# Altium project Madromys.PrjPCB
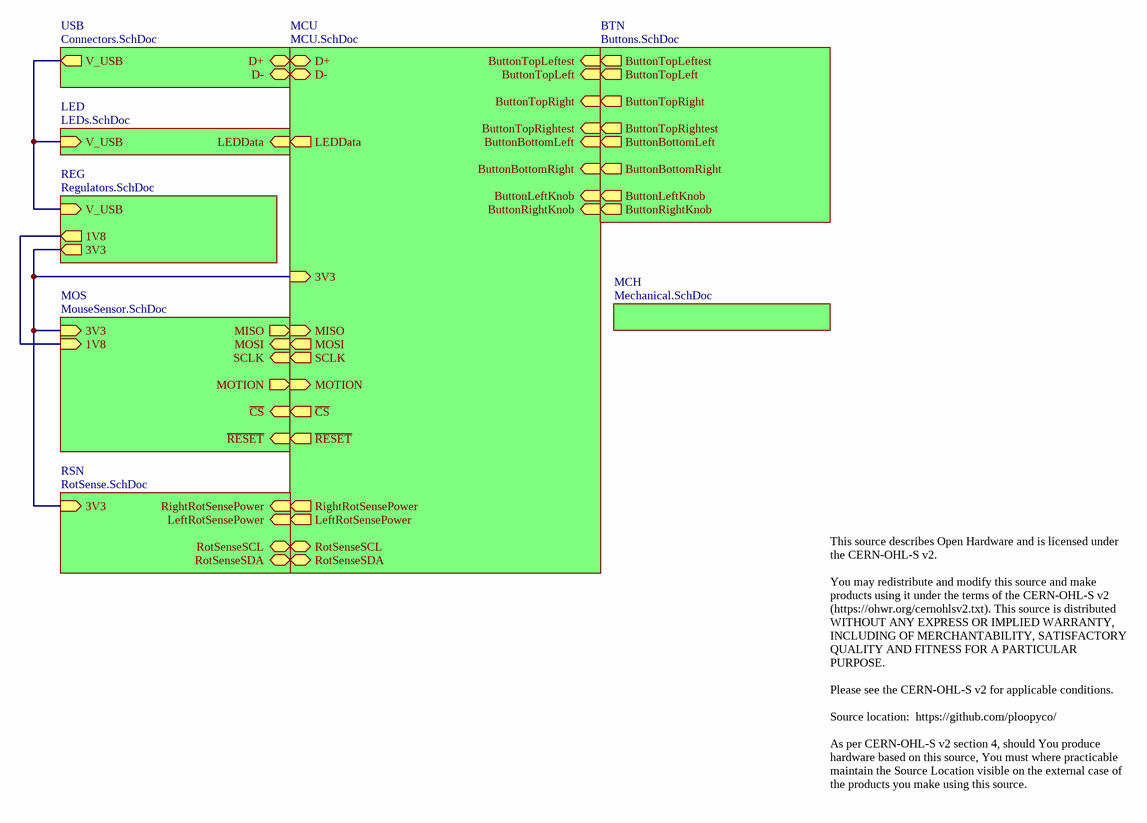
[diagram p0: Madromys.SchDoc]
9 sheets, 86 parts. Net scope: hierarchical (ports join the sheet entries above them; power ports are global).
Board file: Madromys.PcbDoc
Sheets:
  Madromys.SchDoc
    USB = Connectors.SchDoc
    LED = LEDs.SchDoc
    REG = Regulators.SchDoc
    MOS = MouseSensor.SchDoc
    MCU = MCU.SchDoc
    BTN = Buttons.SchDoc
    MCH = Mechanical.SchDoc
    RSN = RotSense.SchDoc

## Sheet Madromys.SchDoc
size Letter; CompanyName: Ploopy Corporation; Organization: Ploopy Corporation; Address1: 137-1140 Burnhamthorpe Road W; Address2: Mississauga; Address3: Ontario; Address4: Canada L5C 0A3; DocumentNumber: 1; Revision: R2.002; SheetNumber: 1; SheetTotal: 9

### Sub-sheets
BTN = Buttons.SchDoc: ButtonTopLeftest (out), ButtonTopLeft (out), ButtonTopRightest (out), ButtonBottomRight (out), ButtonBottomLeft (out), ButtonTopRight (out), ButtonLeftKnob (out), ButtonRightKnob (out)
LED = LEDs.SchDoc: V_USB (in), LEDData (in)
MCH = Mechanical.SchDoc: no entries
MCU = MCU.SchDoc: D+ (bidir), D- (bidir), ButtonTopLeftest (in), ButtonTopLeft (in), LEDData (out), 3V3 (in), MOSI (out), SCLK (out), MISO (in), ~{CS} (out), ~{RESET} (out), MOTION (in), ButtonTopRight (in), ButtonTopRightest (in), ButtonBottomRight (in), ButtonBottomLeft (in), ButtonLeftKnob (in), ButtonRightKnob (in), RightRotSensePower (out), LeftRotSensePower (out), RotSenseSCL (bidir), RotSenseSDA (bidir)
MOS = MouseSensor.SchDoc: 1V8 (in), 3V3 (in), ~{CS} (in), MISO (out), MOSI (in), SCLK (in), ~{RESET} (in), MOTION (out)
REG = Regulators.SchDoc: 3V3 (out), V_USB (in), 1V8 (out)
RSN = RotSense.SchDoc: RightRotSensePower (in), 3V3 (in), LeftRotSensePower (in), RotSenseSCL (bidir), RotSenseSDA (bidir)
USB = Connectors.SchDoc: D+ (bidir), V_USB (out), D- (bidir)

### Nets
1V8: sheet REG/1V8, sheet MOS/1V8
3V3: sheet REG/3V3, sheet MOS/3V3, sheet MCU/3V3, sheet RSN/3V3
LEDData: sheet LED/LEDData, sheet MCU/LEDData
V_USB: sheet USB/V_USB, sheet LED/V_USB, sheet REG/V_USB
NetC9_2: sheet MCU/LeftRotSensePower, sheet RSN/LeftRotSensePower
NetC15_2: sheet MCU/RightRotSensePower, sheet RSN/RightRotSensePower
NetR5_1: sheet MOS/MISO, sheet MCU/MISO
NetR6_2: sheet USB/D-, sheet MCU/D-
NetR7_2: sheet USB/D+, sheet MCU/D+
NetRa2_1: sheet MCU/RotSenseSCL, sheet RSN/RotSenseSCL
NetRa2_3: sheet MCU/RotSenseSDA, sheet RSN/RotSenseSDA
NetSW1_B: sheet MCU/ButtonTopLeftest, sheet BTN/ButtonTopLeftest
NetSW2_B: sheet MCU/ButtonTopLeft, sheet BTN/ButtonTopLeft
NetSW3_B: sheet MCU/ButtonTopRightest, sheet BTN/ButtonTopRightest
NetSW4_B: sheet MCU/ButtonTopRight, sheet BTN/ButtonTopRight
NetSW5_A: sheet MCU/ButtonLeftKnob, sheet BTN/ButtonLeftKnob
NetSW6_B: sheet MCU/ButtonBottomRight, sheet BTN/ButtonBottomRight
NetSW7_A: sheet MCU/ButtonRightKnob, sheet BTN/ButtonRightKnob
NetSW8_B: sheet MCU/ButtonBottomLeft, sheet BTN/ButtonBottomLeft
NetU2_7: sheet MOS/~{RESET}, sheet MCU/~{RESET}
NetU2_9: sheet MOS/MOTION, sheet MCU/MOTION
NetU2_10: sheet MOS/SCLK, sheet MCU/SCLK
NetU2_11: sheet MOS/MOSI, sheet MCU/MOSI
NetU2_13: sheet MOS/~{CS}, sheet MCU/~{CS}

### Notes on the sheet
- This source describes Open Hardware and is licensed under the CERN-OHL-S v2.
  You may redistribute and modify this source and make products using it under the terms of the CERN-OHL-S v2 (https://ohwr.org/cernohlsv2.txt). This source is distributed WITHOUT ANY EXPRESS OR IMPLIED WARRANTY, INCLUDING OF MERCHANTABILITY, SATISFACTORY QUALITY AND FITNESS FOR A PARTICULAR PURPOSE.
  Please see the CERN-OHL-S v2 for applicable conditions.
  Source location:  https://github.com/ploopyco/
  As per CERN-OHL-S v2 section 4, should You produce hardware based on this source, You must where practicable maintain the Source Location visible on the external case of the products you make using this source.
- Copyright Ploopy Corporation
- Licensed under the CERN-OHL-S v2
- http://ohwr.org/cernohl
- Title:
- PCB:
- Version:
- Ploopy Corporation
- Mississauga ON L5C 0A3
- 137-1140 Burnhamthorpe Road W
- Date:
- Time:
- Sheet
- of
- Canada

## Sheet Connectors.SchDoc
size Letter; CompanyName: Ploopy Corporation; Organization: Ploopy Corporation; Address1: 137-1140 Burnhamthorpe Road W; Address2: Mississauga; Address3: Ontario; Address4: Canada L5C 0A3; DocumentNumber: 3; Revision: R2.002; SheetNumber: 3; SheetTotal: 9
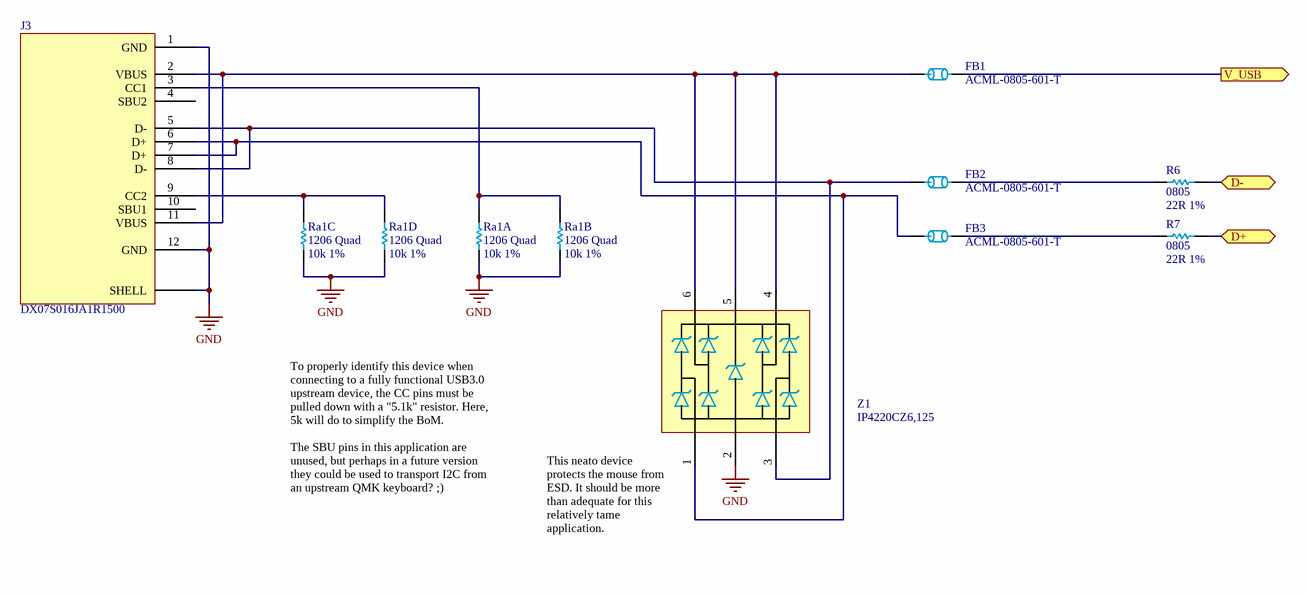
[diagram p1: Connectors.SchDoc]

### Parts
FB1  ACML-0805-601-T  [0805]
FB2  ACML-0805-601-T  [0805]
FB3  ACML-0805-601-T  [0805]
J3  DX07S016JA1R1500  [DX07S016JA1R1500]
R6  0805  value 22R 1%  [0805]
R7  0805  value 22R 1%  [0805]
Ra1  1206 Quad  value 10k 1%  [4x 10k 1% - CAC-80P320X160-8M]  (parts A,B,C,D of 4)
Z1  IP4220CZ6,125  [PESD3V3S4UD - SOT95P275X110-6N]

### Ports
D+ (bidir), D- (bidir), V_USB (out)

### Nets
GND: J3.1(GND) J3.12(GND) J3.SHELL Ra1.1 Ra1.2 Ra1.3 Ra1.4 Z1.2
V_USB: FB1.2 ; port V_USB
NetFB1_1: FB1.1 J3.2(VBUS) J3.11(VBUS) Z1.4 Z1.5 Z1.6
NetFB2_1: FB2.1 J3.5(D-) J3.8(D-) Z1.3
NetFB2_2: FB2.2 R6.1
NetFB3_1: FB3.1 J3.6(D+) J3.7(D+) Z1.1
NetFB3_2: FB3.2 R7.1
NetJ3_3: J3.3(CC1) Ra1.7 Ra1.8
NetJ3_9: J3.9(CC2) Ra1.5 Ra1.6
NetR6_2: R6.2 ; port D-
NetR7_2: R7.2 ; port D+

Not connected (* = marked no-connect by the designer): J3 4(SBU2) 10(SBU1)

### Notes on the sheet
- To properly identify this device when connecting to a fully functional USB3.0 upstream device, the CC pins must be pulled down with a "5.1k" resistor. Here, 5k will do to simplify the BoM.
  The SBU pins in this application are unused, but perhaps in a future version they could be used to transport I2C from an upstream QMK keyboard? ;)
- (near Z1) This neato device protects the mouse from ESD. It should be more than adequate for this relatively tame application.
- Copyright Ploopy Corporation
- Licensed under the CERN-OHL-S v2
- http://ohwr.org/cernohl
- Title:
- PCB:
- Version:
- Ploopy Corporation
- Mississauga ON L5C 0A3
- 137-1140 Burnhamthorpe Road W
- Date:
- Time:
- Sheet
- of
- Canada

### Library data of the parts
FB1-FB3 = ACML-0805-601-T: FERRITE BEAD 600 OHM 0805 1LN; Value: Ferrite Bead 600R; Supplier 1: Digi-Key; Supplier Part Number 1: 535-12556-1-ND
J3 = DX07S016JA1R1500: USB-C (USB TYPE-C) USB 2.0 Receptacle Connector 24 (16+8 Dummy) Position Surface Mount, Right Angle; Through Hole; Supplier 1: Digi-Key; Supplier 2: Mouser; Supplier Part Number 1: 670-DX07S016JA1R1500CT-ND; Supplier Part Number 2: 656-DX07S016JA1R1500
R6 R7 = Res 22R 1% 0805: Chip resistor; Supplier 1: Digi-Key; Supplier 2: Arrow; Supplier Part Number 1: RMCF0805FT22R0CT-ND; Supplier Part Number 2: RMCF0805FT22R0
Ra1 = Quad Res 10k 1% 1206: Chip resistor
Z1 = IP4220CZ6,125: TVS DIODE 5.5V 6TSOP (Low capacitance, USB); Supplier 1: Digi-Key; Supplier 2: Mouser; Supplier 3: Arrow; Supplier Part Number 1: 1727-3578-1-ND; Supplier Part Number 2: 771-IP4220CZ6-T/R; Supplier Part Number 3: IP4220CZ6,125

## Sheet LEDs.SchDoc
size Letter; CompanyName: Ploopy Corporation; Organization: Ploopy Corporation; Address1: 137-1140 Burnhamthorpe Road W; Address2: Mississauga; Address3: Ontario; Address4: Canada L5C 0A3; DocumentNumber: 4; Revision: R2.002; SheetNumber: 4; SheetTotal: 9
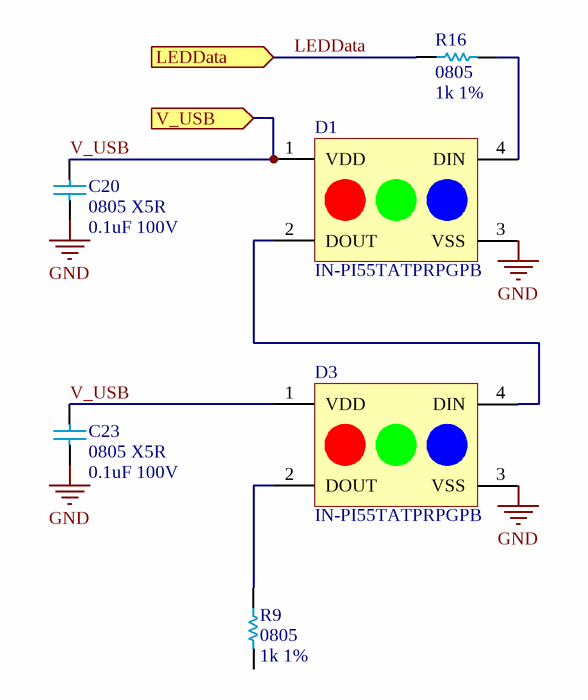
[diagram p2: LEDs.SchDoc]

### Parts
C20  0805 X5R  value 0.1uF 100V  [0805 - TALL]
C23  0805 X5R  value 0.1uF 100V  [0805 - TALL]
D1  IN-PI55TATPRPGPB  [IN-PI55TATPRPGPB]
D3  IN-PI55TATPRPGPB  [IN-PI55TATPRPGPB]
R9  0805  value 1k 1%  [0805]
R16  0805  value 1k 1%  [0805]

### Ports
LEDData (in), V_USB (in)

### Nets
GND: C20.1 C23.1 D1.3(VSS) D3.3(VSS)
LEDData: R16.2 ; port LEDData
V_USB: C20.2 C23.2 D1.1(VDD) D3.1(VDD) ; port V_USB
NetD1_2: D1.2(DOUT) D3.4(DIN)
NetD1_4: D1.4(DIN) R16.1
NetD3_2: D3.2(DOUT) R9.2

Not connected (* = marked no-connect by the designer): R9 1

### Notes on the sheet
- Copyright Ploopy Corporation
- Licensed under the CERN-OHL-S v2
- http://ohwr.org/cernohl
- Title:
- PCB:
- Version:
- Ploopy Corporation
- Mississauga ON L5C 0A3
- 137-1140 Burnhamthorpe Road W
- Date:
- Time:
- Sheet
- of
- Canada

### Library data of the parts
C20 C23 = Cap 0.1uF 100V: 0805, X5R or better; Supplier 1: Digi-Key; Supplier Part Number 1: 1276-6840-2-ND
D1 D3 = IN-PI55TATPRPGPB: ADDRESS LED DISCRETE SERIAL RGB; Supplier 1: Digi-Key; Supplier 2: Arrow; Supplier 3: Mouser; Supplier Part Number 1: 1830-1204-1-ND; Supplier Part Number 2: IN-PI55TATPRPGPB; Supplier Part Number 3: 743-IN-PI55TATPRPGPB
R9 R16 = Res 1k 1% 0805: Chip resistor, 1/8W 100PPM; Supplier 1: Digi-Key; Supplier Part Number 1: RMCF0805FT1K00TR-ND

## Sheet Regulators.SchDoc
size Letter; CompanyName: Ploopy Corporation; Organization: Ploopy Corporation; Address1: 137-1140 Burnhamthorpe Road W; Address2: Mississauga; Address3: Ontario; Address4: Canada L5C 0A3; DocumentNumber: 8; Revision: R2.002; SheetNumber: 8; SheetTotal: 9
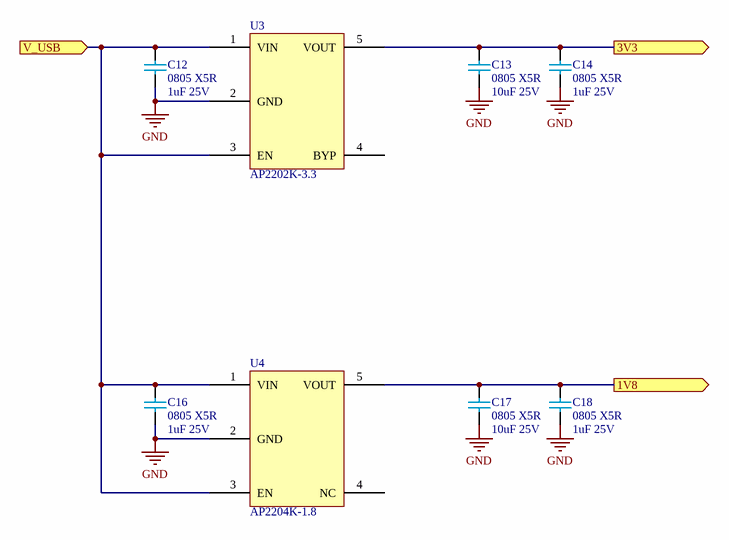
[diagram p3: Regulators.SchDoc]

### Parts
C12  0805 X5R  value 1uF 25V  [0805 - TALL]
C13  0805 X5R  value 10uF 25V  [0805 - TALL]
C14  0805 X5R  value 1uF 25V  [0805 - TALL]
C16  0805 X5R  value 1uF 25V  [0805 - TALL]
C17  0805 X5R  value 10uF 25V  [0805 - TALL]
C18  0805 X5R  value 1uF 25V  [0805 - TALL]
U3  AP2202K-3.3  [AP2202 - SOT95P270X145-5N]
U4  AP2204K-1.8  [AP2202 - SOT95P270X145-5N]

### Ports
1V8 (out), 3V3 (out), V_USB (in)

### Nets
GND: C12.1 C13.1 C14.1 C16.1 C17.1 C18.1 U3.2(GND) U4.2(GND)
1V8: C17.2 C18.2 U4.5(VOUT) ; port 1V8
3V3: C13.2 C14.2 U3.5(VOUT) ; port 3V3
V_USB: C12.2 C16.2 U3.1(VIN) U3.3(EN) U4.1(VIN) U4.3(EN) ; port V_USB

Not connected (* = marked no-connect by the designer): U3 4(BYP); U4 4(NC)

### Notes on the sheet
- Copyright Ploopy Corporation
- Licensed under the CERN-OHL-S v2
- http://ohwr.org/cernohl
- Title:
- PCB:
- Version:
- Ploopy Corporation
- Mississauga ON L5C 0A3
- 137-1140 Burnhamthorpe Road W
- Date:
- Time:
- Sheet
- of
- Canada

### Library data of the parts
C12 C14 C16 C18 = Cap 1uF 25V: 0805, X5R or better; Supplier 1: Digi-Key; Supplier Part Number 1: 1276-1066-2-ND; Supplier 2: Digi-Key; Supplier Part Number 2: 1276-1066-1-ND
C13 C17 = Cap 10uF 25V: 0805, X5R or better; Supplier 1: Mouser; Supplier Part Number 1: 81-GRM21BR61E106KA3L; Supplier 2: Digi-Key; Supplier Part Number 2: 490-5523-1-ND
U3 = AP2202K-3.3: 3.3V 150mA LDO regulator; Supplier 1: Mouser; Supplier Part Number 1: 621-AP2202K-3.3TRG1; Supplier 2: Digi-Key; Supplier Part Number 2: AP2202K-3.3TRG1DICT-ND; Supplier 3: Arrow; Supplier Part Number 3: PWagzdsTFFHKE_U17B45SP-NtndBrheJIaI5hB7gHD0ZVywxIBNyoAQstvnyfZZ0
U4 = AP2204K-1.8: Linear Voltage Regulator IC 1 Output 150mA SOT-23-5; Supplier 1: Digi-Key; Supplier 2: Mouser; Supplier Part Number 1: AP2204K-1.8TRG1DICT-ND; Supplier Part Number 2: 621-AP2204K-1.8TRG1

## Sheet MouseSensor.SchDoc
size Letter; CompanyName: Ploopy Corporation; Organization: Ploopy Corporation; Address1: 137-1140 Burnhamthorpe Road W; Address2: Mississauga; Address3: Ontario; Address4: Canada L5C 0A3; DocumentNumber: 7; Revision: R2.002; SheetNumber: 7; SheetTotal: 9
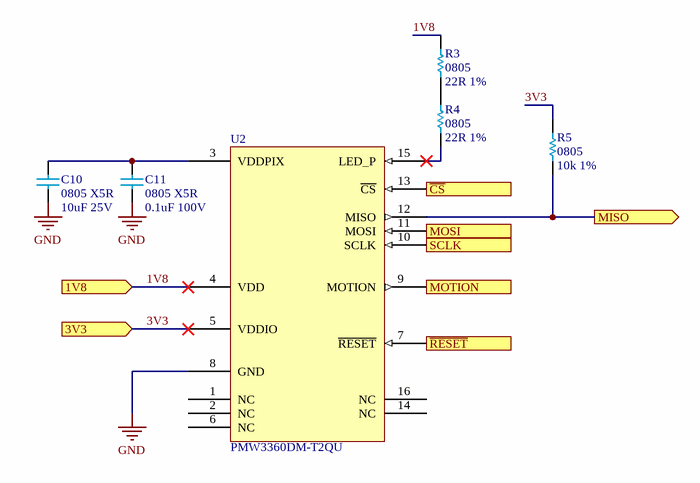
[diagram p4: MouseSensor.SchDoc]

### Parts
C10  0805 X5R  value 10uF 25V  [0805 - TALL]
C11  0805 X5R  value 0.1uF 100V  [0805 - TALL]
R3  0805  value 22R 1%  [0805]
R4  0805  value 22R 1%  [0805]
R5  0805  value 10k 1%  [0805]
U2  PMW3360DM-T2QU  [PMW3360DM-T2QU]

### Ports
1V8 (in), 3V3 (in), MISO (out), MOSI (in), MOTION (out), SCLK (in), ~{CS} (in), ~{RESET} (in)

### Nets
GND: C10.1 C11.1 U2.8(GND)
1V8: R3.2 U2.4(VDD) ; port 1V8
3V3: R5.2 U2.5(VDDIO) ; port 3V3
NetC10_2: C10.2 C11.2 U2.3(VDDPIX)
NetR3_1: R3.1 R4.2
NetR4_1: R4.1 U2.15(LED_P)
NetR5_1: R5.1 U2.12(MISO) ; port MISO
NetU2_7: U2.7(~{RESET}) ; port ~{RESET}
NetU2_9: U2.9(MOTION) ; port MOTION
NetU2_10: U2.10(SCLK) ; port SCLK
NetU2_11: U2.11(MOSI) ; port MOSI
NetU2_13: U2.13(~{CS}) ; port ~{CS}

Not connected (* = marked no-connect by the designer): U2 1(NC) 2(NC) 6(NC) 14(NC) 16(NC)

### Notes on the sheet
- Copyright Ploopy Corporation
- Licensed under the CERN-OHL-S v2
- http://ohwr.org/cernohl
- Title:
- PCB:
- Version:
- Ploopy Corporation
- Mississauga ON L5C 0A3
- 137-1140 Burnhamthorpe Road W
- Date:
- Time:
- Sheet
- of
- Canada

### Library data of the parts
C10 = Cap 10uF 25V: 0805, X5R or better; Supplier 1: Mouser; Supplier Part Number 1: 81-GRM21BR61E106KA3L; Supplier 2: Digi-Key; Supplier Part Number 2: 490-5523-1-ND
C11 = Cap 0.1uF 100V: 0805, X5R or better; Supplier 1: Digi-Key; Supplier Part Number 1: 1276-6840-2-ND
R3 R4 = Res 22R 1% 0805: Chip resistor; Supplier 1: Digi-Key; Supplier 2: Arrow; Supplier Part Number 1: RMCF0805FT22R0CT-ND; Supplier Part Number 2: RMCF0805FT22R0
R5 = Res 10k 1% 0805: Chip resistor; Supplier 1: Digi-Key; Supplier Part Number 1: RMCF0805FT10K0TR-ND
U2 = PMW3360DM-T2QU: Optical Gaming Navigation Sensor

## Sheet MCU.SchDoc
size Tabloid; CompanyName: Ploopy Corporation; Organization: Ploopy Corporation; Address1: 137-1140 Burnhamthorpe Road W; Address2: Mississauga; Address3: Ontario; Address4: Canada L5C 0A3; DocumentNumber: 5; Revision: R2.002; SheetNumber: 5; SheetTotal: 9
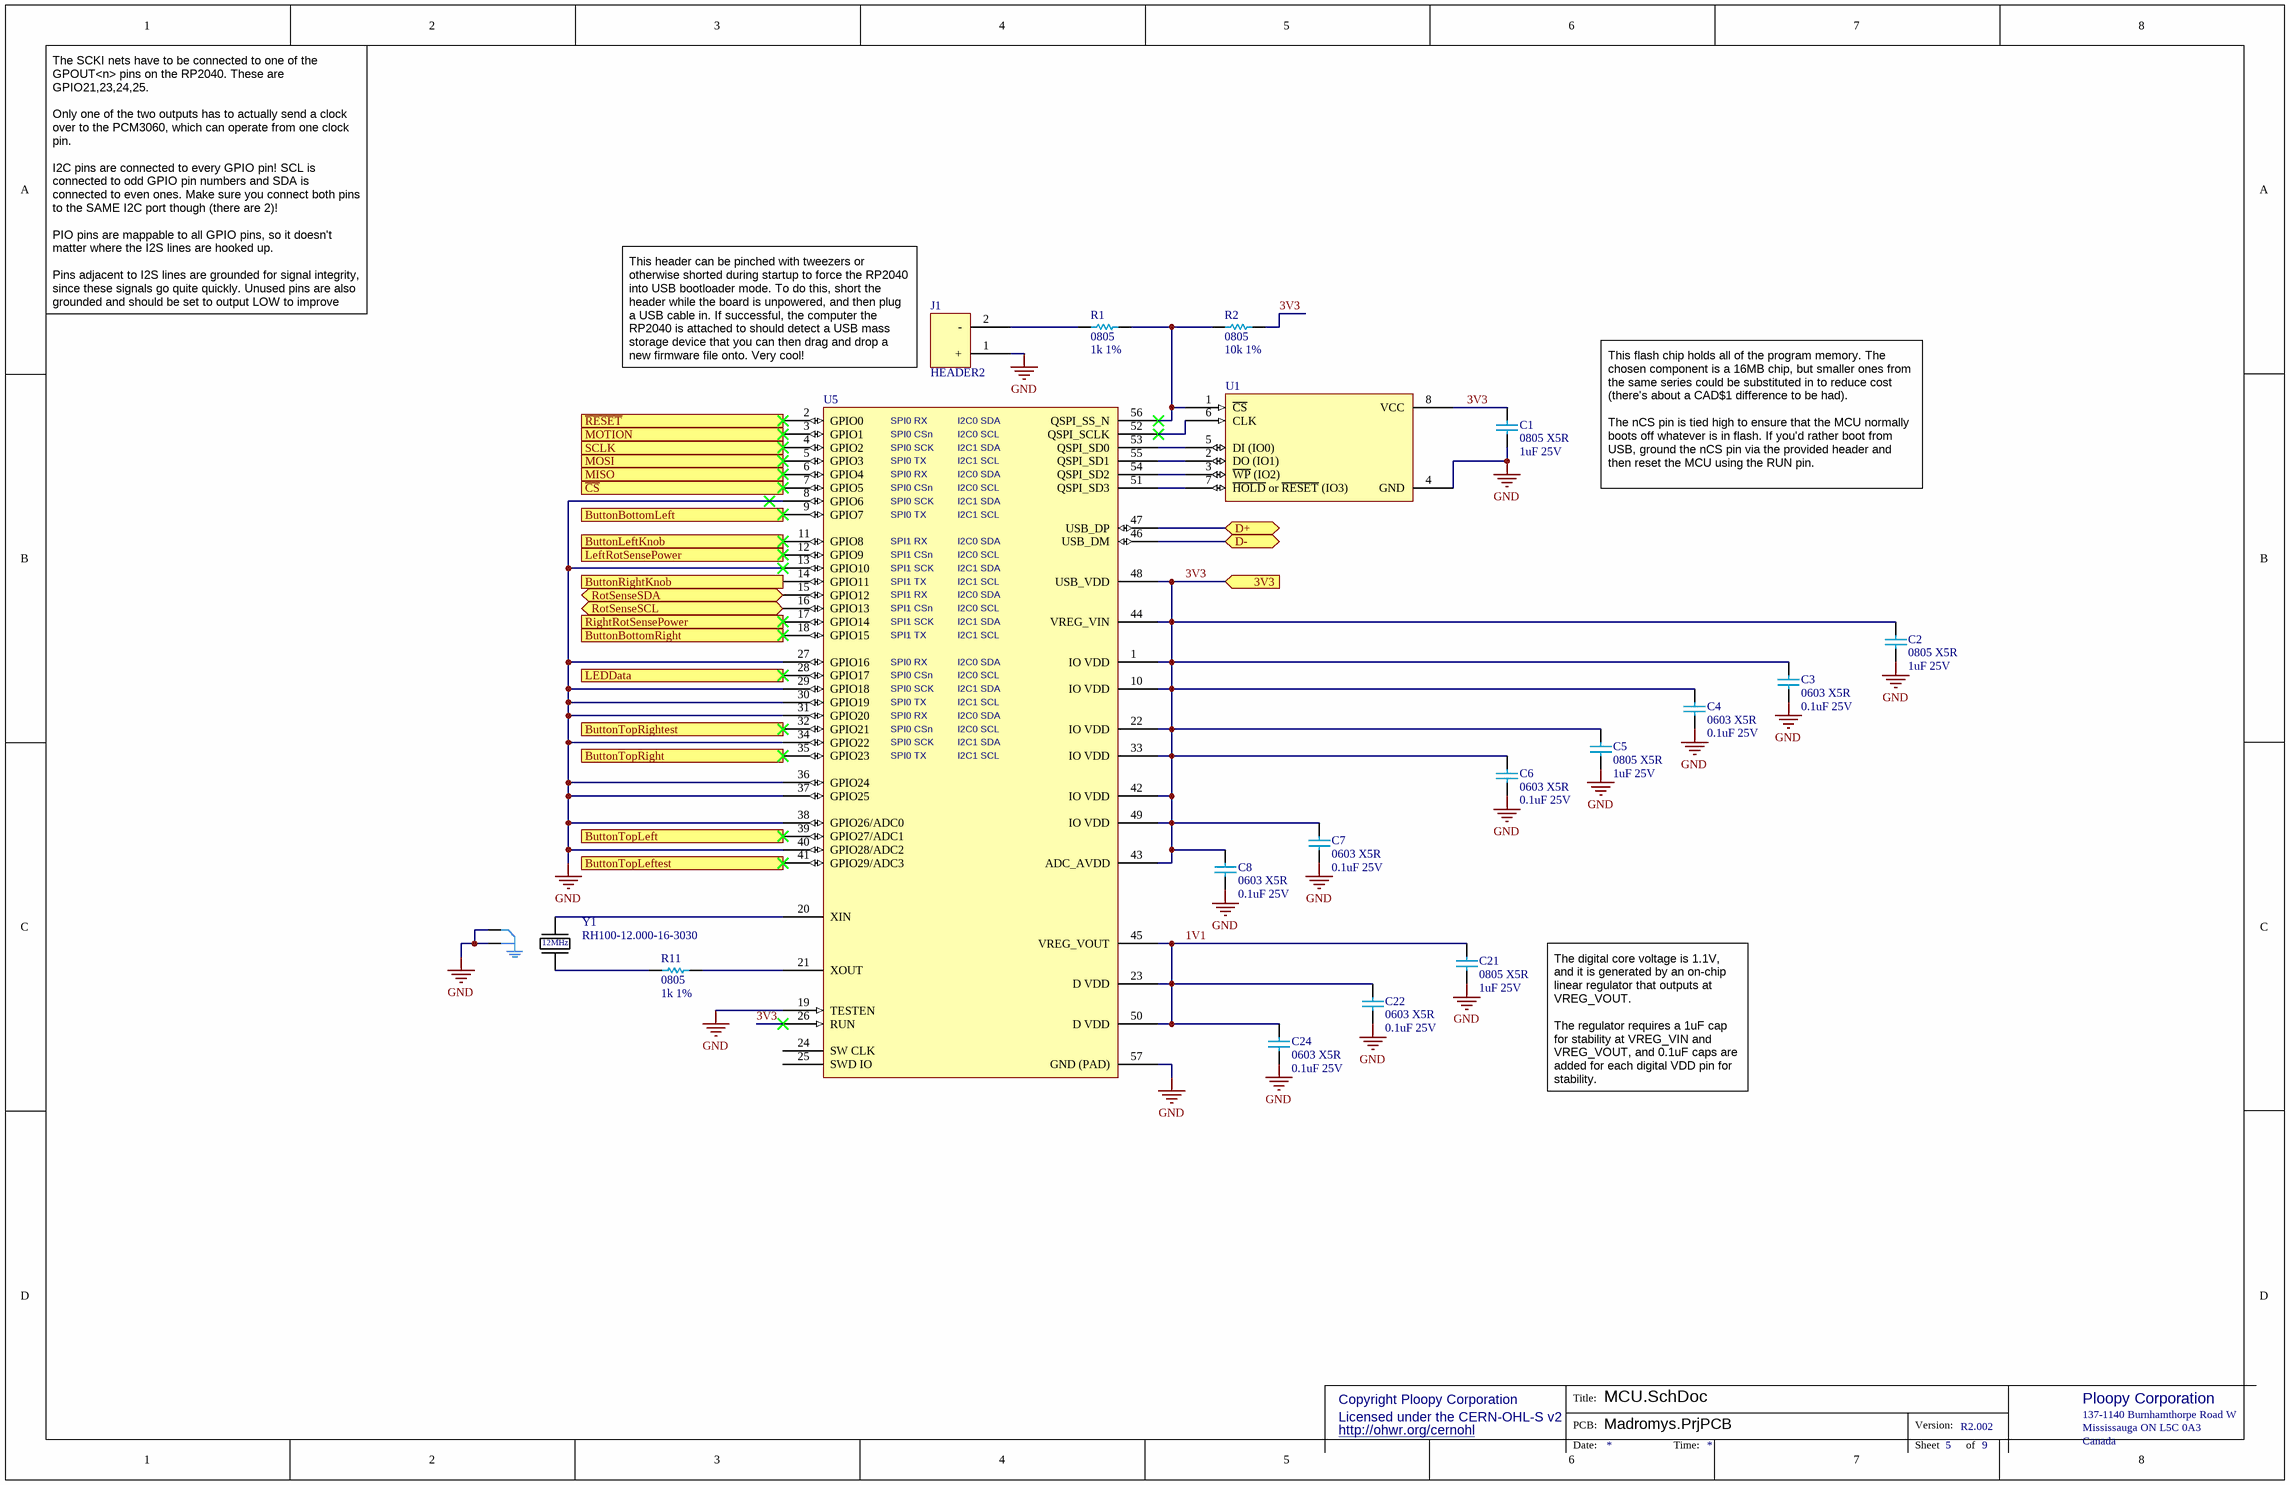
[diagram p5: MCU.SchDoc]

### Parts
C1  0805 X5R  value 1uF 25V  [0805 - TALL]
C2  0805 X5R  value 1uF 25V  [0805 - TALL]
C3  0603 X5R  value 0.1uF 25V  [0603 capacitor - CAPC1608X06N]
C4  0603 X5R  value 0.1uF 25V  [0603 capacitor - CAPC1608X06N]
C5  0805 X5R  value 1uF 25V  [0805 - TALL]
C6  0603 X5R  value 0.1uF 25V  [0603 capacitor - CAPC1608X06N]
C7  0603 X5R  value 0.1uF 25V  [0603 capacitor - CAPC1608X06N]
C8  0603 X5R  value 0.1uF 25V  [0603 capacitor - CAPC1608X06N]
C21  0805 X5R  value 1uF 25V  [0805 - TALL]
C22  0603 X5R  value 0.1uF 25V  [0603 capacitor - CAPC1608X06N]
C24  0603 X5R  value 0.1uF 25V  [0603 capacitor - CAPC1608X06N]
J1  HEADER2  [2x1]
R1  0805  value 1k 1%  [0805]
R2  0805  value 10k 1%  [0805]
R11  0805  value 1k 1%  [0805]
U1  W25Q16JVSSIQ  [W25Q128JVS - SOIC127P790X216-8M]  (value not drawn)
U5  RP2040  [RP2040 - QFN40P700X700X90_HS-57M]  (value not drawn)
Y1  RH100-12.000-16-3030  [RH100-12.000-16-3030]

### Ports
3V3 (in), ButtonBottomLeft (in), ButtonBottomRight (in), ButtonLeftKnob (in), ButtonRightKnob (in), ButtonTopLeft (in), ButtonTopLeftest (in), ButtonTopRight (in), ButtonTopRightest (in), D+ (bidir), D- (bidir), LEDData (out), LeftRotSensePower (out), MISO (in), MOSI (out), MOTION (in), RightRotSensePower (out), RotSenseSCL (bidir), RotSenseSDA (bidir), SCLK (out), ~{CS} (out), ~{RESET} (out)

### Nets
GND: C1.1 C2.1 C3.1 C4.1 C5.1 C6.1 C7.1 C8.1 C21.1 C22.1 C24.1 J1.1(+) U1.4(GND) U5.8(GPIO6) U5.13(GPIO10) U5.19(TESTEN) U5.27(GPIO16) U5.29(GPIO18) U5.30(GPIO19) U5.31(GPIO20) U5.34(GPIO22) U5.36(GPIO24) U5.37(GPIO25) U5.38(GPIO26/ADC0) U5.40(GPIO28/ADC2) U5.57(GND_(PAD)) Y1.2 Y1.4
1V1: C21.2 C22.2 C24.2 U5.23(D_VDD) U5.45(VREG_VOUT) U5.50(D_VDD)
3V3: C1.2 C2.2 C3.2 C4.2 C5.2 C6.2 C7.2 C8.2 R2.1 U1.8(VCC) U5.1(IO_VDD) U5.10(IO_VDD) U5.22(IO_VDD) U5.26(RUN) U5.33(IO_VDD) U5.42(IO_VDD) U5.43(ADC_AVDD) U5.44(VREG_VIN) U5.48(USB_VDD) U5.49(IO_VDD) ; port 3V3
LEDData: U5.28(GPIO17) ; port LEDData
NetC9_2: U5.12(GPIO9) ; port LeftRotSensePower
NetC15_2: U5.17(GPIO14) ; port RightRotSensePower
NetJ1_2: J1.2(-) R1.1
NetR1_2: R1.2 R2.2 U1.1(~{CS}) U5.56(QSPI_SS_N)
NetR5_1: U5.6(GPIO4) ; port MISO
NetR6_2: U5.46(USB_DM) ; port D-
NetR7_2: U5.47(USB_DP) ; port D+
NetR11_1: R11.1 U5.21(XOUT)
NetR11_2: R11.2 Y1.3
NetRa2_1: U5.16(GPIO13) ; port RotSenseSCL
NetRa2_3: U5.15(GPIO12) ; port RotSenseSDA
NetSW1_B: U5.41(GPIO29/ADC3) ; port ButtonTopLeftest
NetSW2_B: U5.39(GPIO27/ADC1) ; port ButtonTopLeft
NetSW3_B: U5.32(GPIO21) ; port ButtonTopRightest
NetSW4_B: U5.35(GPIO23) ; port ButtonTopRight
NetSW5_A: U5.11(GPIO8) ; port ButtonLeftKnob
NetSW6_B: U5.18(GPIO15) ; port ButtonBottomRight
NetSW7_A: U5.14(GPIO11) ; port ButtonRightKnob
NetSW8_B: U5.9(GPIO7) ; port ButtonBottomLeft
NetU1_2: U1.2(DO_(IO1)) U5.55(QSPI_SD1)
NetU1_3: U1.3(~{WP}_(IO2)) U5.54(QSPI_SD2)
NetU1_5: U1.5(DI_(IO0)) U5.53(QSPI_SD0)
NetU1_6: U1.6(CLK) U5.52(QSPI_SCLK)
NetU1_7: U1.7(~{HOLD}_or_~{RESET}_(IO3)) U5.51(QSPI_SD3)
NetU2_7: U5.2(GPIO0) ; port ~{RESET}
NetU2_9: U5.3(GPIO1) ; port MOTION
NetU2_10: U5.4(GPIO2) ; port SCLK
NetU2_11: U5.5(GPIO3) ; port MOSI
NetU2_13: U5.7(GPIO5) ; port ~{CS}
NetU5_20: U5.20(XIN) Y1.1

Not connected (* = marked no-connect by the designer): U5 24(SW_CLK) 25(SWD_IO)

### Notes on the sheet
- The SCKI nets have to be connected to one of the GPOUT<n> pins on the RP2040. These are GPIO21,23,24,25.
  Only one of the two outputs has to actually send a clock over to the PCM3060, which can operate from one clock pin.
  I2C pins are connected to every GPIO pin! SCL is connected to odd GPIO pin numbers and SDA is connected to even ones. Make sure you connect both pins to the SAME I2C port though (there are 2)!
  PIO pins are mappable to all GPIO pins, so it doesn't matter where the I2S lines are hooked up.
  Pins adjacent to I2S lines are grounded for signal integrity, since these signals go quite quickly. Unused pins are also grounded and should be set to output LOW to improve grounding.
- This header can be pinched with tweezers or otherwise shorted during startup to force the RP2040 into USB bootloader mode. To do this, short the header while the board is unpowered, and then plug a USB cable in. If successful, the computer the RP2040 is attached to should detect a USB mass storage device that you can then drag and drop a new firmware file onto. Very cool!
- This flash chip holds all of the program memory. The chosen component is a 16MB chip, but smaller ones from the same series could be substituted in to reduce cost (there's about a CAD$1 difference to be had).
  The nCS pin is tied high to ensure that the MCU normally boots off whatever is in flash. If you'd rather boot from USB, ground the nCS pin via the provided header and then reset the MCU using the RUN pin.
- The digital core voltage is 1.1V, and it is generated by an on-chip linear regulator that outputs at VREG_VOUT.
  The regulator requires a 1uF cap for stability at VREG_VIN and VREG_VOUT, and 0.1uF caps are added for each digital VDD pin for stability.
- Copyright Ploopy Corporation
- Licensed under the CERN-OHL-S v2
- http://ohwr.org/cernohl
- Title:
- PCB:
- Version:
- Ploopy Corporation
- Mississauga ON L5C 0A3
- 137-1140 Burnhamthorpe Road W
- Date:
- Time:
- Sheet
- of
- Canada
- (in symbol RH100-12.000-16-3030) 12MHz
- (in symbol RP2040) SPI0 RX; I2C0 SDA; SPI0 CSn; I2C0 SCL; SPI0 SCK; I2C1 SDA; SPI0 TX; I2C1 SCL; SPI1 RX; SPI1 CSn; SPI1 SCK; SPI1 TX

### Library data of the parts
C1 C2 C5 C21 = Cap 1uF 25V: 0805, X5R or better; Supplier 1: Digi-Key; Supplier Part Number 1: 1276-1066-2-ND; Supplier 2: Digi-Key; Supplier Part Number 2: 1276-1066-1-ND
C3 C4 C6-C8 C22 C24 = Cap 0.1uF 25V: 0603, X5R or better; Supplier 1: Digi-Key; Supplier Part Number 1: 1276-6840-2-ND
J1 = HEADER2: 2-pin 0.100" header; Supplier 1: Mouser; Supplier Part Number 1: 855-M20-9990245; Supplier 2: Digi-Key; Supplier Part Number 2: 952-2261-ND
R1 R11 = Res 1k 1% 0805: Chip resistor, 1/8W 100PPM; Supplier 1: Digi-Key; Supplier Part Number 1: RMCF0805FT1K00TR-ND
R2 = Res 10k 1% 0805: Chip resistor; Supplier 1: Digi-Key; Supplier Part Number 1: RMCF0805FT10K0TR-ND
Y1 = RH100-12.000-16-3030: 12MHz Crystal 16pF 100 Ohms 4-SMD, No Lead (3.2mm x 2.5mm); Supplier 1: Digi-Key; Supplier 2: Mouser; Supplier Part Number 1: XC2686CT-ND; Supplier Part Number 2: 520-160-12-30B-AGMT
U1 = W25Q16JVSSIQ: Supplier 1: Digi-Key; Supplier Part Number 1: W25Q16JVSSIQ-ND
U5 = RP2040: Supplier 1: Newark; Supplier Part Number 1: 49AJ8740

## Sheet Buttons.SchDoc
size Letter; CompanyName: Ploopy Corporation; Organization: Ploopy Corporation; Address1: 137-1140 Burnhamthorpe Road W; Address2: Mississauga; Address3: Ontario; Address4: Canada L5C 0A3; DocumentNumber: 2; Revision: R2.002; SheetNumber: 2; SheetTotal: 9
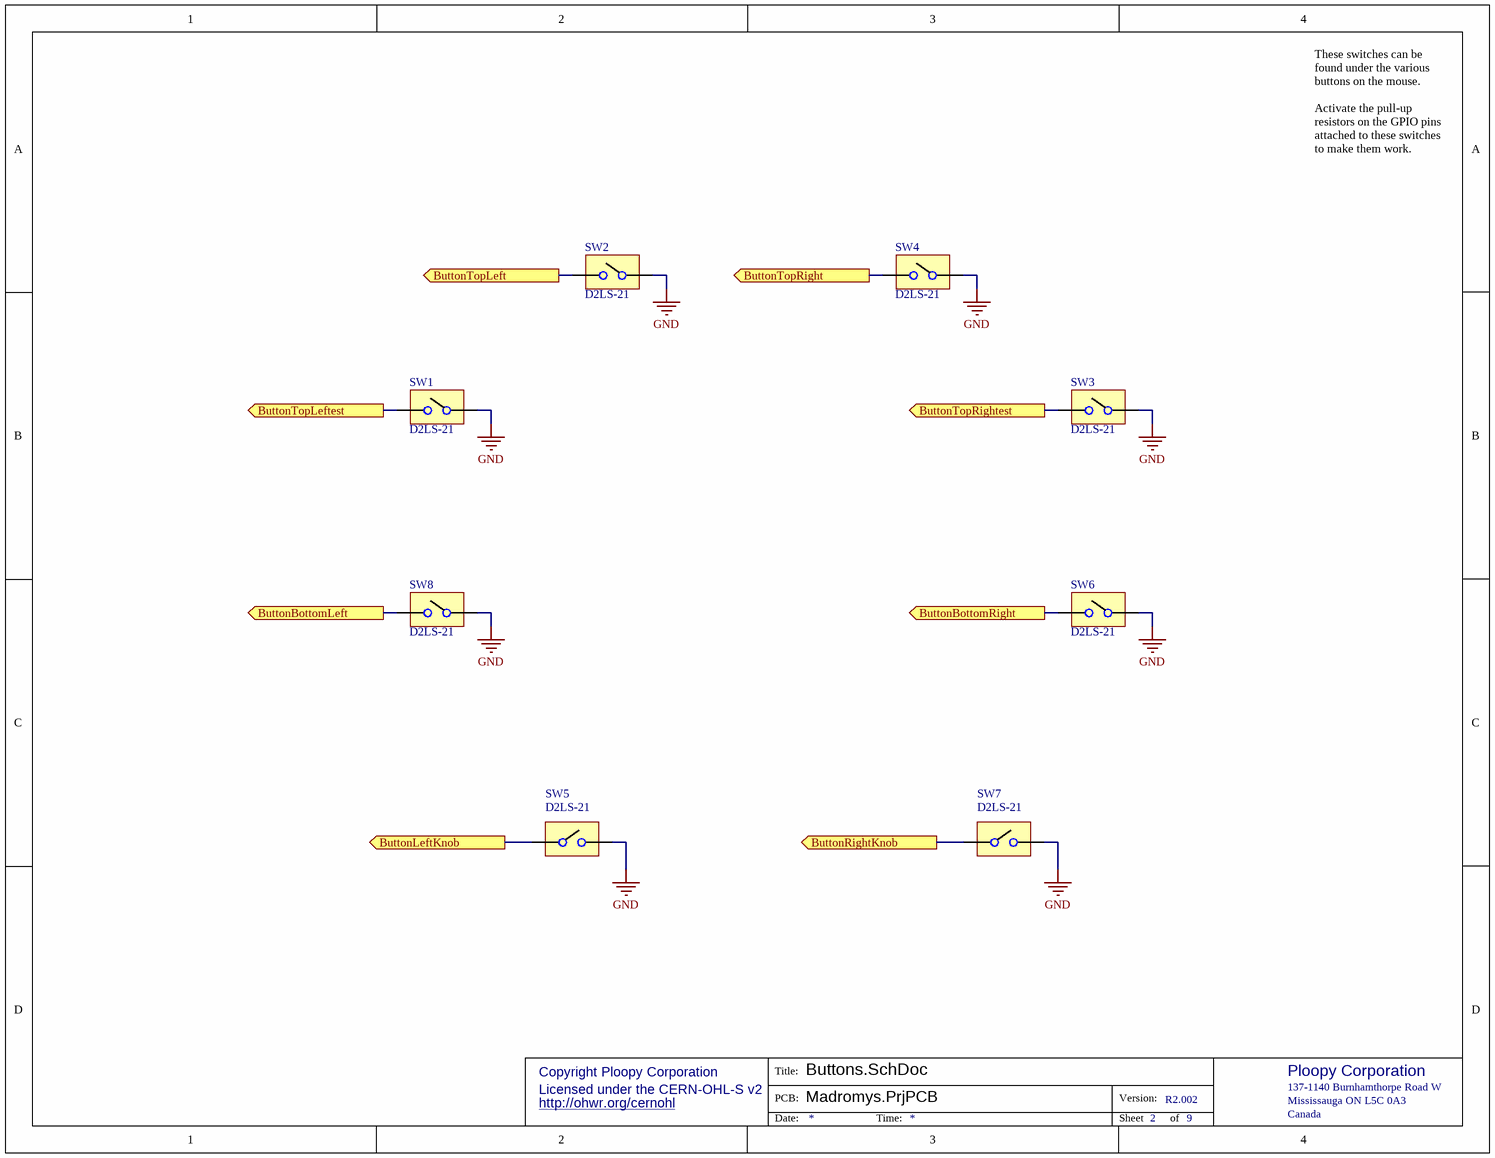
[diagram p6: Buttons.SchDoc]

### Parts
SW1  D2LS-21  [D2LS-21]
SW2  D2LS-21  [D2LS-21]
SW3  D2LS-21  [D2LS-21]
SW4  D2LS-21  [D2LS-21]
SW5  D2LS-21  [D2LS-21]
SW6  D2LS-21  [D2LS-21]
SW7  D2LS-21  [D2LS-21]
SW8  D2LS-21  [D2LS-21]

### Ports
ButtonBottomLeft (out), ButtonBottomRight (out), ButtonLeftKnob (out), ButtonRightKnob (out), ButtonTopLeft (out), ButtonTopLeftest (out), ButtonTopRight (out), ButtonTopRightest (out)

### Nets
GND: SW1.A SW2.A SW3.A SW4.A SW5.B SW6.A SW7.B SW8.A
NetSW1_B: SW1.B ; port ButtonTopLeftest
NetSW2_B: SW2.B ; port ButtonTopLeft
NetSW3_B: SW3.B ; port ButtonTopRightest
NetSW4_B: SW4.B ; port ButtonTopRight
NetSW5_A: SW5.A ; port ButtonLeftKnob
NetSW6_B: SW6.B ; port ButtonBottomRight
NetSW7_A: SW7.A ; port ButtonRightKnob
NetSW8_B: SW8.B ; port ButtonBottomLeft

### Notes on the sheet
- These switches can be found under the various buttons on the mouse.
  Activate the pull-up resistors on the GPIO pins attached to these switches to make them work.
- Copyright Ploopy Corporation
- Licensed under the CERN-OHL-S v2
- http://ohwr.org/cernohl
- Title:
- PCB:
- Version:
- Ploopy Corporation
- Mississauga ON L5C 0A3
- 137-1140 Burnhamthorpe Road W
- Date:
- Time:
- Sheet
- of
- Canada

### Library data of the parts
SW1-SW8 = D2LS-21: Compact Surface-mounting Switch for long durability; Supplier 1: Digi-Key; Supplier 2: Mouser; Supplier Part Number 1: Z4378CT-ND; Supplier Part Number 2: 653-D2LS-21

## Sheet Mechanical.SchDoc
size Letter; CompanyName: Ploopy Corporation; Organization: Ploopy Corporation; Address1: 137-1140 Burnhamthorpe Road W; Address2: Mississauga; Address3: Ontario; Address4: Canada L5C 0A3; DocumentNumber: 6; Revision: R2.002; SheetNumber: 6; SheetTotal: 9
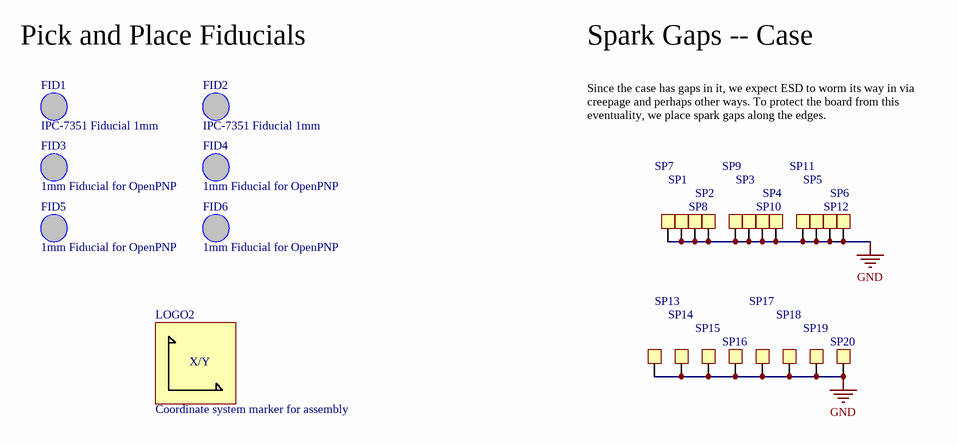
[diagram p7: Mechanical.SchDoc]

### Parts
FID1  IPC-7351 Fiducial 1mm  [FIDUCIAL_1.5]
FID2  IPC-7351 Fiducial 1mm  [FIDUCIAL_1.5]
FID3  1mm Fiducial for OpenPNP  [FIDUCIAL-NEW]
FID4  1mm Fiducial for OpenPNP  [FIDUCIAL-NEW]
FID5  1mm Fiducial for OpenPNP  [FIDUCIAL-NEW]
FID6  1mm Fiducial for OpenPNP  [FIDUCIAL-NEW]
LOGO2  Coordinate system marker for assembly  [Coordinate System]  (no BOM)
SP1  Spark Gap  [SparkGap]  (value not drawn)  (no BOM)
SP2  Spark Gap  [SparkGap]  (value not drawn)  (no BOM)
SP3  Spark Gap  [SparkGap]  (value not drawn)  (no BOM)
SP4  Spark Gap  [SparkGap]  (value not drawn)  (no BOM)
SP5  Spark Gap  [SparkGap]  (value not drawn)  (no BOM)
SP6  Spark Gap  [SparkGap]  (value not drawn)  (no BOM)
SP7  Spark Gap  [SparkGap]  (value not drawn)  (no BOM)
SP8  Spark Gap  [SparkGap]  (value not drawn)  (no BOM)
SP9  Spark Gap  [SparkGap]  (value not drawn)  (no BOM)
SP10  Spark Gap  [SparkGap]  (value not drawn)  (no BOM)
SP11  Spark Gap  [SparkGap]  (value not drawn)  (no BOM)
SP12  Spark Gap  [SparkGap]  (value not drawn)  (no BOM)
SP13  Spark Gap  [SparkGap]  (value not drawn)  (no BOM)
SP14  Spark Gap  [SparkGap]  (value not drawn)  (no BOM)
SP15  Spark Gap  [SparkGap]  (value not drawn)  (no BOM)
SP16  Spark Gap  [SparkGap]  (value not drawn)  (no BOM)
SP17  Spark Gap  [SparkGap]  (value not drawn)  (no BOM)
SP18  Spark Gap  [SparkGap]  (value not drawn)  (no BOM)
SP19  Spark Gap  [SparkGap]  (value not drawn)  (no BOM)
SP20  Spark Gap  [SparkGap]  (value not drawn)  (no BOM)

### Nets
GND: SP1.1 SP2.1 SP3.1 SP4.1 SP5.1 SP6.1 SP7.1 SP8.1 SP9.1 SP10.1 SP11.1 SP12.1 SP13.1 SP14.1 SP15.1 SP16.1 SP17.1 SP18.1 SP19.1 SP20.1

Not connected (* = marked no-connect by the designer): FID1 1; FID2 1; FID3 1; FID4 1; FID5 1; FID6 1

### Notes on the sheet
- Pick and Place Fiducials
- Spark Gaps -- Case
- Since the case has gaps in it, we expect ESD to worm its way in via creepage and perhaps other ways. To protect the board from this eventuality, we place spark gaps along the edges.
- Copyright Ploopy Corporation
- Licensed under the CERN-OHL-S v2
- http://ohwr.org/cernohl
- Title:
- PCB:
- Version:
- Ploopy Corporation
- Mississauga ON L5C 0A3
- 137-1140 Burnhamthorpe Road W
- Date:
- Time:
- Sheet
- of
- Canada
- (in symbol CoordinateSystem) X/Y

### Library data of the parts
FID1 FID2 = FIDUCIAL_1.5: PNP-Nzl: 2; PNP-dx: 0; PNP-X: 4; PNP-A: 1; PNP-Thk: 1.02; PNP-TS: 70; PNP-Type: MARK1; PNP-dy: 0; PNP-Y: 4; PNP-Pt: 0; PNP-W: 0; PNP-Lv: 1; PNP-Level: 1; PNP-Voff: 0; PNP-FeedType: Fiducial; PNP-TapeWidth: 0; PNP-PlacePriority: 0; PNP-TapeIndex: 0; PNP-da: 0
FID3-FID6 = FIDUCIAL_NEW: This fiducial is designed to work with OpenPNP. It presents a circular pattern under the solder mask, to prevent glare issues from messing with the detection.; PNP-Nzl: 2; PNP-dx: 0; PNP-X: 4; PNP-A: 1; PNP-Thk: 1.02; PNP-TS: 70; PNP-Type: MARK1; PNP-dy: 0; PNP-Y: 4; PNP-Pt: 0; PNP-W: 0; PNP-Lv: 1; PNP-Level: 1; PNP-Voff: 0; PNP-FeedType: Fiducial; PNP-TapeWidth: 0; PNP-PlacePriority: 0; PNP-TapeIndex: 0; PNP-da: 0
LOGO2 = CoordinateSystem
SP1-SP20 = Spark Gap: Open square pad for spark gapping; PNP-Nzl: 2; PNP-dx: 0; PNP-X: 1; PNP-TS: 70; PNP-Type: CHI; PNP-FeedType: Tape; PNP-TapeWidth: 8; PNP-dy: 0; PNP-Y: 1; PNP-A: 0; PNP-Pt: 0; PNP-W: 0; PNP-Thk: 1; PNP-Lv: 1; PNP-Level: 1; PNP-Voff: 0; PNP-PlacePriority: 1; PNP-TapeIndex: 1; PNP-da: 0

## Sheet RotSense.SchDoc
size Letter; CompanyName: Ploopy Corporation; Organization: Ploopy Corporation; Address1: Suite 226, 137-1140 Burnhamthorpe Road W; Address2: Mississauga; Address3: Ontario; Address4: Canada L5C 0A3; DocumentNumber: 9; Revision: R2.002; SheetNumber: 9; SheetTotal: 9
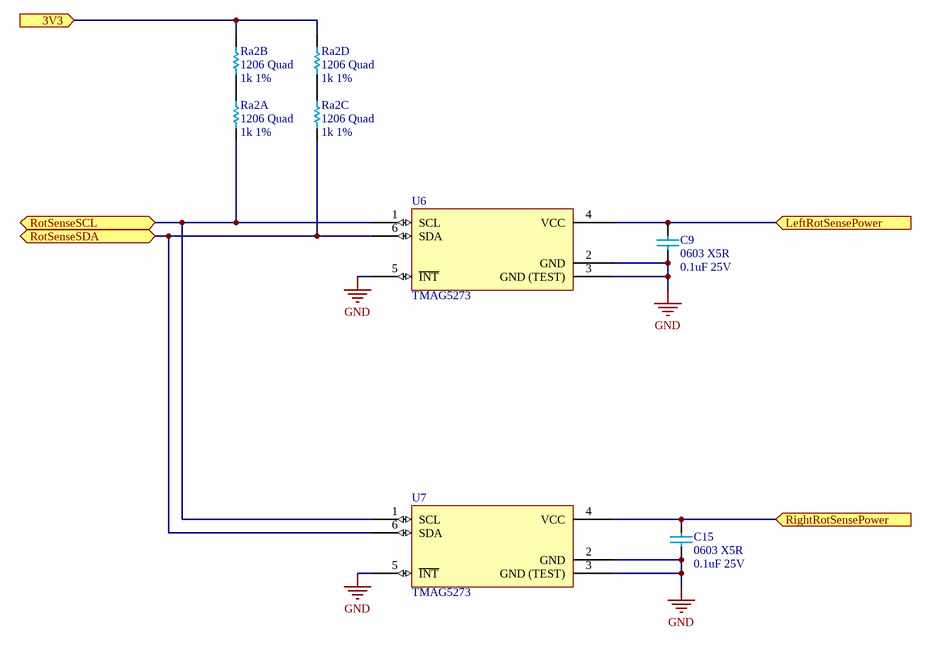
[diagram p8: RotSense.SchDoc]

### Parts
C9  0603 X5R  value 0.1uF 25V  [0603 capacitor - CAPC1608X06N]
C15  0603 X5R  value 0.1uF 25V  [0603 capacitor - CAPC1608X06N]
Ra2  1206 Quad  value 1k 1%  [4x 1k 1% - CAC-80P320X160-8M]  (parts A,B,C,D of 4)
U6  TMAG5273  [TMAG5273 - SOT95P280X145-6M]
U7  TMAG5273  [TMAG5273 - SOT95P280X145-6M]

### Ports
3V3 (in), LeftRotSensePower (in), RightRotSensePower (in), RotSenseSCL (bidir), RotSenseSDA (bidir)

### Nets
GND: C9.1 C15.1 U6.2(GND) U6.3(GND_(TEST)) U6.5(~{INT}) U7.2(GND) U7.3(GND_(TEST)) U7.5(~{INT})
3V3: Ra2.5 Ra2.7 ; port 3V3
NetC9_2: C9.2 U6.4(VCC) ; port LeftRotSensePower
NetC15_2: C15.2 U7.4(VCC) ; port RightRotSensePower
NetRa2_1: Ra2.1 U6.1(SCL) U7.1(SCL) ; port RotSenseSCL
NetRa2_2: Ra2.2 Ra2.8
NetRa2_3: Ra2.3 U6.6(SDA) U7.6(SDA) ; port RotSenseSDA
NetRa2_4: Ra2.4 Ra2.6

### Notes on the sheet
- Copyright Ploopy Corporation
- Licensed under the CERN-OHL-S v2
- http://ohwr.org/cernohl
- Title:
- PCB:
- Version:
- Ploopy Corporation
- Mississauga ON L5C 0A3
- 137-1140 Burnhamthorpe Road W
- Date:
- Time:
- Sheet
- of
- Canada

### Library data of the parts
C9 C15 = Cap 0.1uF 25V: 0603, X5R or better; Supplier 1: Digi-Key; Supplier Part Number 1: 1276-6840-2-ND
Ra2 = Quad Res 1k 1% 1206: Chip resistor
U6 U7 = TMAG5273: Low-Power Linear 3D Hall-Effect Sensor With I2C Interface

## Nets that join several sheets
GND: Connectors (8 pins), LEDs (C20.1 C23.1 D1.3 D3.3), Regulators (8 pins), MouseSensor (C10.1 C11.1 U2.8), MCU (28 pins), Buttons (8 pins), Mechanical (20 pins), RotSense (8 pins)
1V8: Regulators (C17.2 C18.2 U4.5), MouseSensor (R3.2 U2.4)
3V3: Regulators (C13.2 C14.2 U3.5), MouseSensor (R5.2 U2.5), MCU (20 pins), RotSense (Ra2.5 Ra2.7)
LEDData: LEDs (R16.2), MCU (U5.28)
NetC9_2: MCU (U5.12), RotSense (C9.2 U6.4)
NetC15_2: MCU (U5.17), RotSense (C15.2 U7.4)
NetR5_1: MouseSensor (R5.1 U2.12), MCU (U5.6)
NetR6_2: Connectors (R6.2), MCU (U5.46)
NetR7_2: Connectors (R7.2), MCU (U5.47)
NetRa2_1: MCU (U5.16), RotSense (Ra2.1 U6.1 U7.1)
NetRa2_3: MCU (U5.15), RotSense (Ra2.3 U6.6 U7.6)
NetSW1_B: MCU (U5.41), Buttons (SW1.B)
NetSW2_B: MCU (U5.39), Buttons (SW2.B)
NetSW3_B: MCU (U5.32), Buttons (SW3.B)
NetSW4_B: MCU (U5.35), Buttons (SW4.B)
NetSW5_A: MCU (U5.11), Buttons (SW5.A)
NetSW6_B: MCU (U5.18), Buttons (SW6.B)
NetSW7_A: MCU (U5.14), Buttons (SW7.A)
NetSW8_B: MCU (U5.9), Buttons (SW8.B)
NetU2_7: MouseSensor (U2.7), MCU (U5.2)
NetU2_9: MouseSensor (U2.9), MCU (U5.3)
NetU2_10: MouseSensor (U2.10), MCU (U5.4)
NetU2_11: MouseSensor (U2.11), MCU (U5.5)
NetU2_13: MouseSensor (U2.13), MCU (U5.7)
V_USB: Connectors (FB1.2), LEDs (C20.2 C23.2 D1.1 D3.1), Regulators (6 pins)

## Assembly variants
BoM: not fitted REG.C.15